# Altium schematic sheet JTAG.SchDoc: Apalis Evaluation Board 1.1
size A3; Organization: Toradex AG; Address1: Altsagenstrasse 5; Address2: Horw; Address3: 6048; Address4: Switzerland; DocumentNumber: 31; Revision: V1.1; SheetNumber: 31; SheetTotal: 32; PageSetup: Record=PageOptions|CenterHorizontal=True|CenterVertical=True|PrintScale=0.73|XCorrection=1.00|YCorrection=1.00|PrintKind=0|BorderSize=5000000|LeftOffset=0|BottomOffset=0|Orientation=2|PaperLength=1000|PaperWidth=1000|Scale=100|PaperSource=7|PrintQuality=-4|MediaType=1|DitherType=10|PaperKind=A4|PrintScaleMode=1
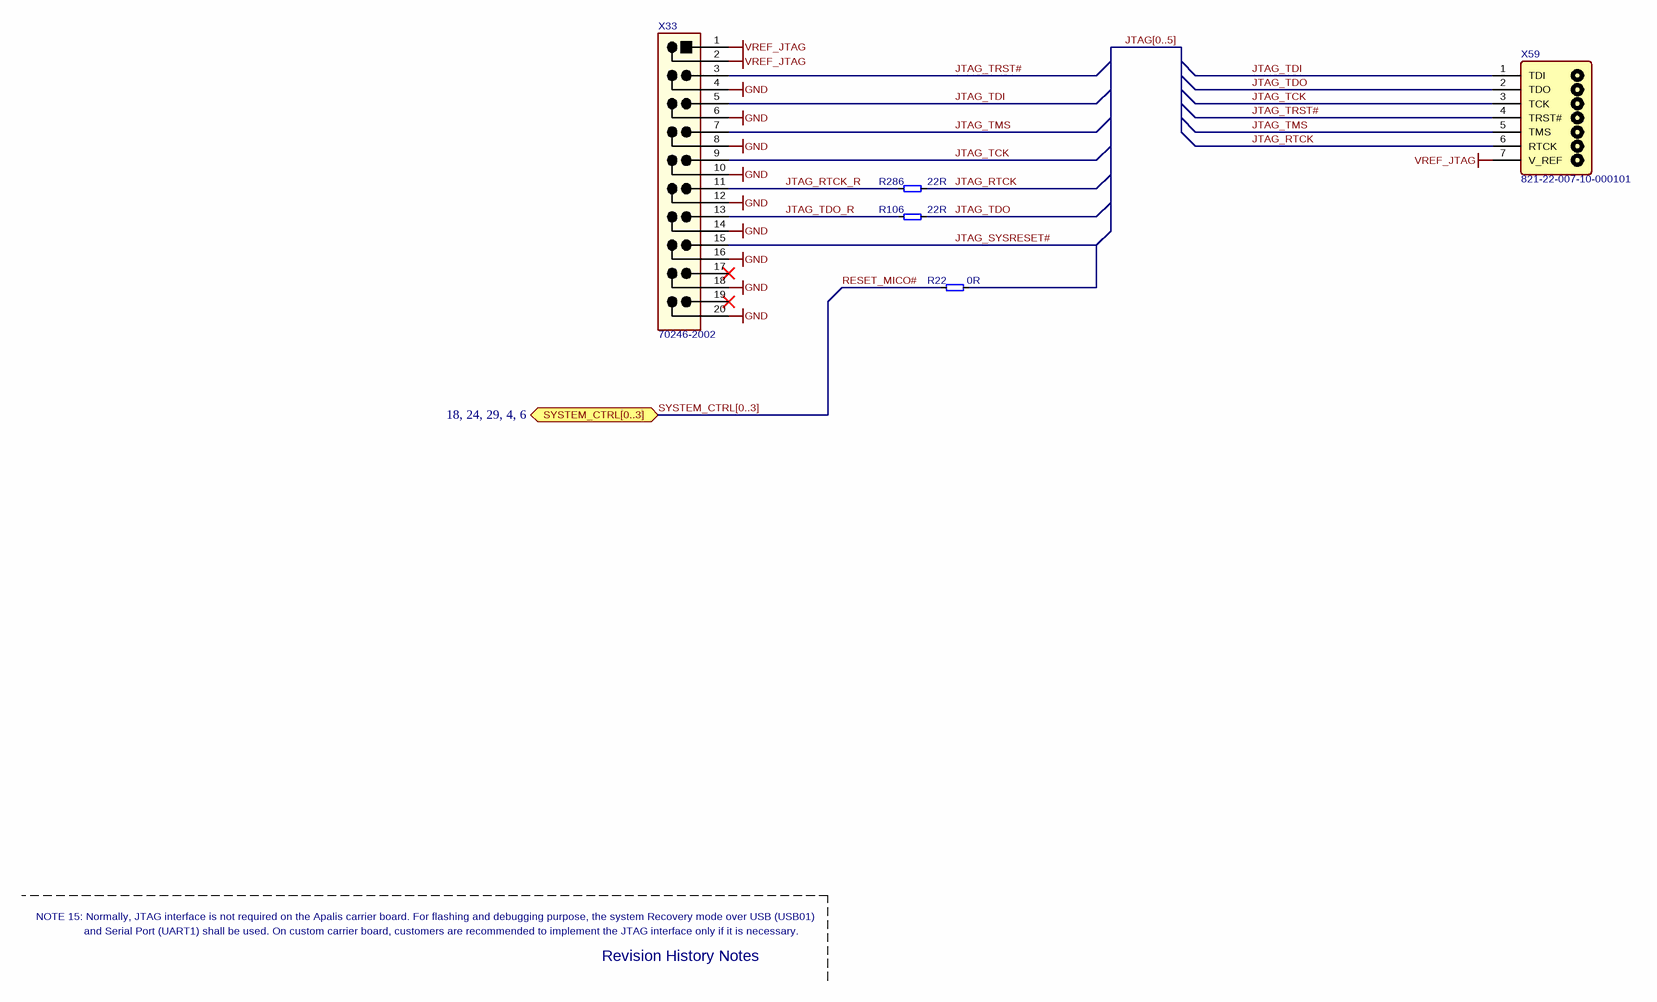
[diagram p0: JTAG.SchDoc]

## Parts
R22  0R  [T_RESC0603X30N]
R106  22R  [T_RESC0603X30N]
R286  22R  [T_RESC0603X30N]
X33  70246-2002  [T_Molex_70246-2002]
X59  821-22-007-10-000101  [T_MILL-MAX_821-22-007-10-000101]

## Ports
SYSTEM_CTRL[0..3] (bidir, see 18, 24, 29, 4, 6)

## Nets
GND: X33.4 X33.6 X33.8 X33.10 X33.12 X33.14 X33.16 X33.18 X33.20
VREF_JTAG: X33.1 X33.2 X59.7(V_REF)
JTAG_RTCK: R286.2 X59.6(RTCK)
JTAG_RTCK_R: R286.1 X33.11
JTAG_SYSRESET#: R22.2 X33.15
JTAG_TCK: X33.9 X59.3(TCK)
JTAG_TDI: X33.5 X59.1(TDI)
JTAG_TDO: R106.2 X59.2(TDO)
JTAG_TDO_R: R106.1 X33.13
JTAG_TMS: X33.7 X59.5(TMS)
JTAG_TRST#: X33.3 X59.4(TRST#)
RESET_MICO#: R22.1

Not connected (* = marked no-connect by the designer): X33 17* 19*

## Buses and harness runs
bus JTAG[0..5]
bus SYSTEM_CTRL[0..3] = port SYSTEM_CTRL[0..3]

## Notes on the sheet
- NOTE 15: Normally, JTAG interface is not required on the Apalis carrier board. For flashing and debugging purpose, the system Recovery mode over USB (USB01)
- and Serial Port (UART1) shall be used. On custom carrier board, customers are recommended to implement the JTAG interface only if it is necessary.
- Revision History Notes
- Title
- Size:
- Date:
- A3
- Number:
- Time:
- Revision:
- Sheet
- of
- File:

## Library data of the parts
R22 = R-0R-63mW-1%-0603: Resistor 0 ohm 63mW 1% 0603; Rating: 63mW; Tolerance: 1%; Value: 0R
R106 R286 = R-22R-63mW-5%-0603: Resistor 22 ohm 63mW 5% 0603; Rating: 63mW; Tolerance: 5%; Value: 22R
X33 = CON-Molex-70246-2002: Header shrouded male, 2x10 pin 2.54mm pitch; Manufacturer Name: Molex; No. of ways: 2x10; Pitch: 2.54mm; Manufacturer Part No.: 70246-2002
X59 = CON-MM-821-22-007-10-000101: JTAG Pogo pins; Manufacturer Name: Mill-Max; Manufacturer Part No.: 821-22-007-10-000101